# Altium project NyitraiBenceA3.PrjPcb
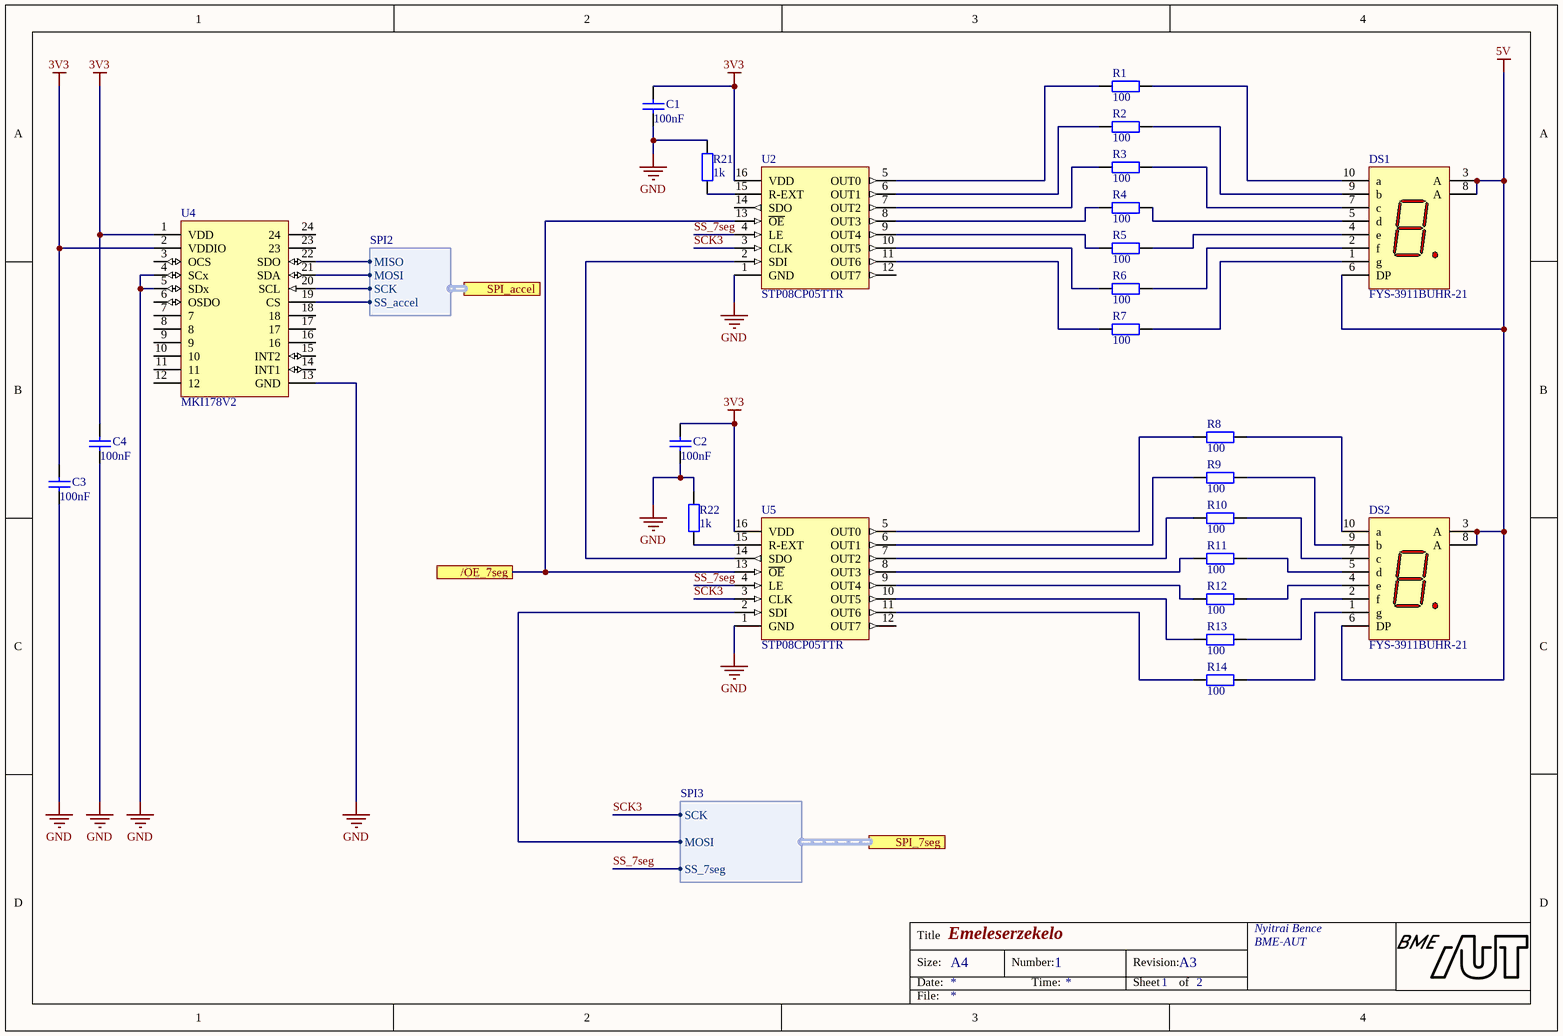
[diagram p0: Accelo_7seg.SchDoc]
2 sheets, 38 parts. Net scope: flat (ports and power ports of the same name join across sheets).
Board file: hazi_kiindulas.PcbDoc
Sheets:
  Accelo_7seg.SchDoc
  Nucleo_Pb_Buzzer.SchDoc

## Sheet Accelo_7seg.SchDoc: Emeleserzekelo
size A4; Author: Nyitrai Bence; Organization: BME-AUT; DocumentNumber: 1; Revision: A3; SheetNumber: 1; SheetTotal: 2

### Parts
C1  100nF  [FP_0805_CAP_085]
C2  100nF  [FP_0805_CAP_085]
C3  100nF  [FP_0805_CAP_085]
C4  100nF  [FP_0805_CAP_085]
DS1  FYS-3911BUHR-21  [FP_7SEG]
DS2  FYS-3911BUHR-21  [FP_7SEG]
R1  100  [FP_0805_RES]
R2  100  [FP_0805_RES]
R3  100  [FP_0805_RES]
R4  100  [FP_0805_RES]
R5  100  [FP_0805_RES]
R6  100  [FP_0805_RES]
R7  100  [FP_0805_RES]
R8  100  [FP_0805_RES]
R9  100  [FP_0805_RES]
R10  100  [FP_0805_RES]
R11  100  [FP_0805_RES]
R12  100  [FP_0805_RES]
R13  100  [FP_0805_RES]
R14  100  [FP_0805_RES]
R21  1k  [FP_0805_RES]
R22  1k  [FP_0805_RES]
U2  STP08CP05TTR  [TSOP65P640X120-16M]
U4  MKI178V2  [FP_DIL24]
U5  STP08CP05TTR  [TSOP65P640X120-16M]

### Ports
/OE_7seg, SPI_7seg (harness SPI3), SPI_accel (harness SPI2)

### Harnesses
SPI2: MISO, SCK, MOSI, SS_accel
SPI3: MOSI, SCK, SS_7seg

### Nets
3V3: C1.2 C2.2 C3.2 C4.2 U2.16(VDD) U4.1(VDD) U4.2(VDDIO) U5.16(VDD)
5V: DS1.3(A) DS1.6(DP) DS1.8(A) DS2.3(A) DS2.6(DP) DS2.8(A)
GND: C1.1 C2.1 C3.1 C4.1 R21.1 R22.1 U2.1(GND) U4.4(SCx) U4.5(SDx) U4.13(GND) U5.1(GND)
SCK2: U4.20(SCL) ; port SPI_accel.SCK
SCK3: U2.3(CLK) U5.3(CLK) ; port SPI_7seg.SCK
SS_7seg: U2.4(LE) U5.4(LE) ; port SPI_7seg.SS_7seg
NetDS1_1: DS1.1(g) R7.2
NetDS1_2: DS1.2(f) R6.2
NetDS1_4: DS1.4(e) R5.2
NetDS1_5: DS1.5(d) R4.2
NetDS1_7: DS1.7(c) R3.2
NetDS1_9: DS1.9(b) R2.2
NetDS1_10: DS1.10(a) R1.2
NetDS2_1: DS2.1(g) R14.2
NetDS2_2: DS2.2(f) R13.2
NetDS2_4: DS2.4(e) R12.2
NetDS2_5: DS2.5(d) R11.2
NetDS2_7: DS2.7(c) R10.2
NetDS2_9: DS2.9(b) R9.2
NetDS2_10: DS2.10(a) R8.2
NetR1_1: R1.1 U2.5(OUT0)
NetR2_1: R2.1 U2.6(OUT1)
NetR3_1: R3.1 U2.7(OUT2)
NetR4_1: R4.1 U2.8(OUT3)
NetR5_1: R5.1 U2.9(OUT4)
NetR6_1: R6.1 U2.10(OUT5)
NetR7_1: R7.1 U2.11(OUT6)
NetR8_1: R8.1 U5.5(OUT0)
NetR9_1: R9.1 U5.6(OUT1)
NetR10_1: R10.1 U5.7(OUT2)
NetR11_1: R11.1 U5.8(OUT3)
NetR12_1: R12.1 U5.9(OUT4)
NetR13_1: R13.1 U5.10(OUT5)
NetR14_1: R14.1 U5.11(OUT6)
NetR21_2: R21.2 U2.15(R-EXT)
NetR22_2: R22.2 U5.15(R-EXT)
NetU1_34: U4.19(CS) ; port SPI_accel.SS_accel
NetU1_35: U4.22(SDO) ; port SPI_accel.MISO
NetU1_36: U5.2(SDI) ; port SPI_7seg.MOSI
NetU1_37: U4.21(SDA) ; port SPI_accel.MOSI
NetU1_52: U2.13(~{OE}) U5.13(~{OE}) ; port /OE_7seg
NetU2_2: U2.2(SDI) U5.14(SDO)

Not connected (* = marked no-connect by the designer): U2 12(OUT7) 14(SDO); U4 3(OCS) 6(OSDO) 7 8 9 10 11 12 14(INT1) 15(INT2) 16 17 18 23 24; U5 12(OUT7)

### Notes on the sheet
- Title
- Size:
- Date:
- A4
- Number:
- Time:
- Revision:
- Sheet
- of
- File:

### Library data of the parts
C1-C4 = CAP: Capacitor; Name: 100nF 0805 10% 50V X7R 0805B104K500CT (WAL); Supplier: Lomex; Reference: 82-10-76; Value: 100nF
DS1 DS2 = 7SEG Red-CA: 7-Segment Display; ComponentLink1Description: Manufacturer Link; ComponentLink1URL: http://www.agilent.com/; Supplier: Lomex; Reference: 35-03-94; Name: FYS-3911BUHR-21
R1-R14 R21 R22 = RES: Resistor; Power: 125 mW; Name: 100R 0805 5% RC0805JR-10100RL 0.125W (YAG); Reference: [81-34-71; Supplier: Lomex
  R1-R14: Value: 100
  R21 R22: Value: 1k
U2 U5 = STP08CP05TTR: Low voltage, low current power 8-bit shift register; Supplier: ST tanszeki forras; Name: STP08CP05TTR
U4 = MKI160V1: LSM6DS3 inertial module adapter; Name: MKI178V2; Supplier: ST tanszeki forras

## Sheet Nucleo_Pb_Buzzer.SchDoc: Emeleserzekelo
size A4; Author: Nyitrai Bence; Organization: BME-AUT; DocumentNumber: 2; Revision: A3; SheetNumber: 2; SheetTotal: 2
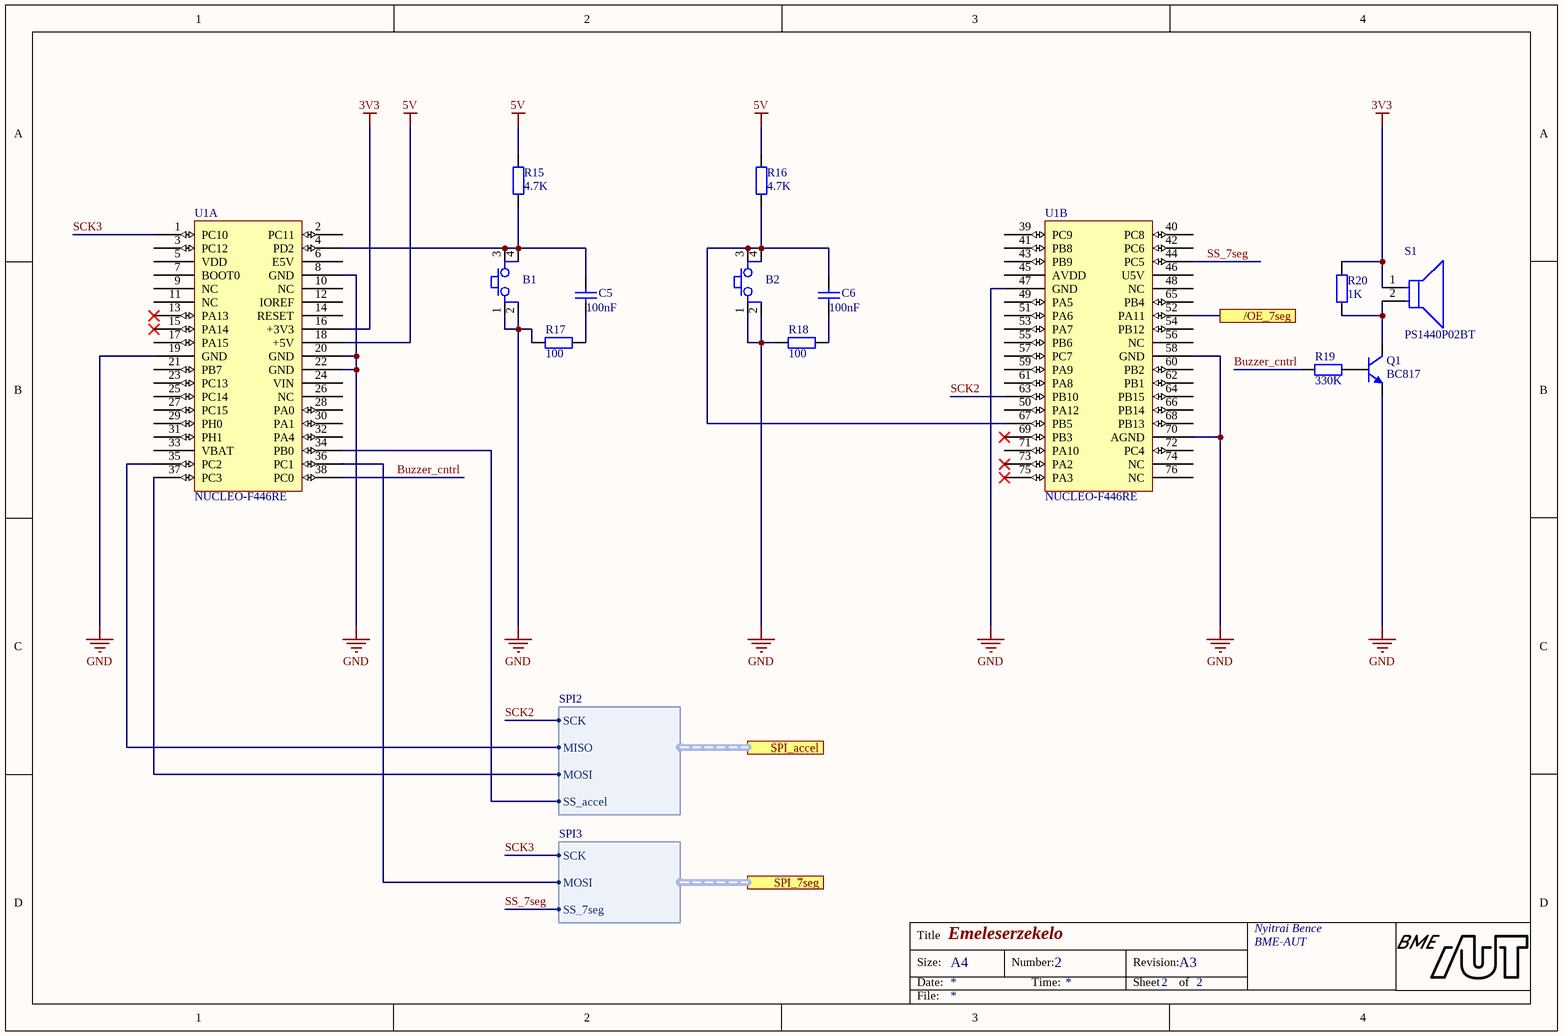
[diagram p1: Nucleo_Pb_Buzzer.SchDoc]

### Parts
B1  Button  [FP_BTN_SMD]  (value not drawn)
B2  Button  [FP_BTN_SMD]  (value not drawn)
C5  100nF  [FP_0805_CAP_085]
C6  100nF  [FP_0805_CAP_085]
Q1  BC817  [FP_SOT23-3]
R15  4.7K  [FP_0805_RES]
R16  4.7K  [FP_0805_RES]
R17  100  [FP_0805_RES]
R18  100  [FP_0805_RES]
R19  330K  [FP_0805_RES]
R20  1K  [FP_0805_RES]
S1  PS1440P02BT  [FP-PS1440P02BT-MFG]
U1  NUCLEO-F446RE  [FP_NUCLEO-64_2x20]  (parts A,B of 2)

### Ports
/OE_7seg, SPI_7seg (harness SPI3), SPI_accel (harness SPI2)

### Harnesses
SPI2: MISO, SCK, MOSI, SS_accel
SPI3: MOSI, SCK, SS_7seg

### Nets
3V3: R20.2 S1.1 U1.16(+3V3)
5V: R15.2 R16.2 U1.18(+5V)
GND: B1.1 B1.2 B2.1 B2.2 Q1.2(E) R17.1 R18.1 U1.8(GND) U1.19(GND) U1.20(GND) U1.22(GND) U1.47(GND) U1.58(GND) U1.70(AGND)
Buzzer_cntrl: R19.1 U1.38(PC0)
SCK2: U1.63(PB10) ; port SPI_accel.SCK
SCK3: U1.1(PC10) ; port SPI_7seg.SCK
SS_7seg: U1.44(PC5) ; port SPI_7seg.SS_7seg
NetB1_3: B1.3 B1.4 C5.2 R15.1 U1.4(PD2)
NetB2_3: B2.3 B2.4 C6.2 R16.1 U1.67(PB5)
NetC5_1: C5.1 R17.2
NetC6_1: C6.1 R18.2
NetQ1_1: Q1.1(B) R19.2
NetQ1_3: Q1.3(C) R20.1 S1.2
NetU1_34: U1.34(PB0) ; port SPI_accel.SS_accel
NetU1_35: U1.35(PC2) ; port SPI_accel.MISO
NetU1_36: U1.36(PC1) ; port SPI_7seg.MOSI
NetU1_37: U1.37(PC3) ; port SPI_accel.MOSI
NetU1_52: U1.52(PA11) ; port /OE_7seg

Not connected (* = marked no-connect by the designer): U1 2(PC11) 3(PC12) 5(VDD) 6(E5V) 7(BOOT0) 9(NC) 10(NC) 11(NC) 12(IOREF) 13(PA13)* 14(RESET) 15(PA14)* 17(PA15) 21(PB7) 23(PC13) 24(VIN) 25(PC14) 26(NC) 27(PC15) 28(PA0) 29(PH0) 30(PA1) 31(PH1) 32(PA4) 33(VBAT) 39(PC9) 40(PC8) 41(PB8) 42(PC6) 43(PB9) 45(AVDD) 46(U5V) 48(NC) 49(PA5) 50(PA12) 51(PA6) 53(PA7) 54(PB12) 55(PB6) 56(NC) 57(PC7) 59(PA9) 60(PB2) 61(PA8) 62(PB1) 64(PB15) 65(PB4) 66(PB14) 68(PB13) 69(PB3)* 71(PA10) 72(PC4) 73(PA2)* 74(NC) 75(PA3)* 76(NC)

### Notes on the sheet
- Title
- Size:
- Date:
- A4
- Number:
- Time:
- Revision:
- Sheet
- of
- File:

### Library data of the parts
B1 B2 = Button 4P: Push button; Name: TACT 6x 6 4P SPST 2 FSM4JSMA 4-1437565-1 (TYC) 50mA 12VDC SMD H=5mm 160g BLACK HEAD; Reference: 45-05-43; Supplier: Lomex
C5 C6 = CAP: as C1 on sheet Accelo_7seg; Supplier: Lomex; Reference: 82-10-76; Value: 100nF
Q1 = BC817: NPN General-purpose Transistor; Reference: 506308; Name: BC817-40; ComponentLink1Description: Manufacturer Link; ComponentLink1URL: http://www.semiconductors.philips.com/; ComponentLink2Description: Datasheet; ComponentLink2URL: http://www.semiconductors.philips.com/acrobat/datasheets/BC817_BC817W_BC337_5.pdf; Supplier: Farnell
R15 R16 = RES: Resistor; Power: 125 mW; Name: 4K70 0805 5% RS-05K472JT 0.125W (FNG); Supplier: Lomex; Reference: 81-35-61; Value: 4.7K
R17 R18 = RES: as R1 on sheet Accelo_7seg; Supplier: Lomex; Value: 100
R19 = RES: Resistor; Power: 125 mW; Name: 330K 0805 5% CR-05JL7--330K 0.125W (VIK); Supplier: Lomex; Reference: 81-11-16; Value: 330K
R20 = RES: Resistor; Power: 125 mW; Name: 1K00 0805 5% CR-05JL7----1K 0.125W (VIK); Supplier: Lomex; Reference: 81-10-87; Value: 1K
S1 = PS1440P02BT: AUDIO PIEZO TRANSDUCER 30V TH; Reference: 3212600; Supplier: Farnell; Name: PS1440P02BT
U1 = NUCLEO-F446RE: Reference: NUCLEO; Name: Nucleo F446RE; Supplier: Tanszék

## Nets that join several sheets
3V3: Accelo_7seg (8 pins), Nucleo_Pb_Buzzer (R20.2 S1.1 U1.16)
5V: Accelo_7seg (6 pins), Nucleo_Pb_Buzzer (R15.2 R16.2 U1.18)
GND: Accelo_7seg (11 pins), Nucleo_Pb_Buzzer (14 pins)
NetU1_34: Accelo_7seg (U4.19), Nucleo_Pb_Buzzer (U1.34)
NetU1_35: Accelo_7seg (U4.22), Nucleo_Pb_Buzzer (U1.35)
NetU1_36: Accelo_7seg (U5.2), Nucleo_Pb_Buzzer (U1.36)
NetU1_37: Accelo_7seg (U4.21), Nucleo_Pb_Buzzer (U1.37)
NetU1_52: Accelo_7seg (U2.13 U5.13), Nucleo_Pb_Buzzer (U1.52)
SCK2: Accelo_7seg (U4.20), Nucleo_Pb_Buzzer (U1.63)
SCK3: Accelo_7seg (U2.3 U5.3), Nucleo_Pb_Buzzer (U1.1)
SS_7seg: Accelo_7seg (U2.4 U5.4), Nucleo_Pb_Buzzer (U1.44)